# Altium schematic sheet DB10012_ControlPower.SchDoc: Power supply
size A4; SheetNumber: 2; SheetTotal: 6
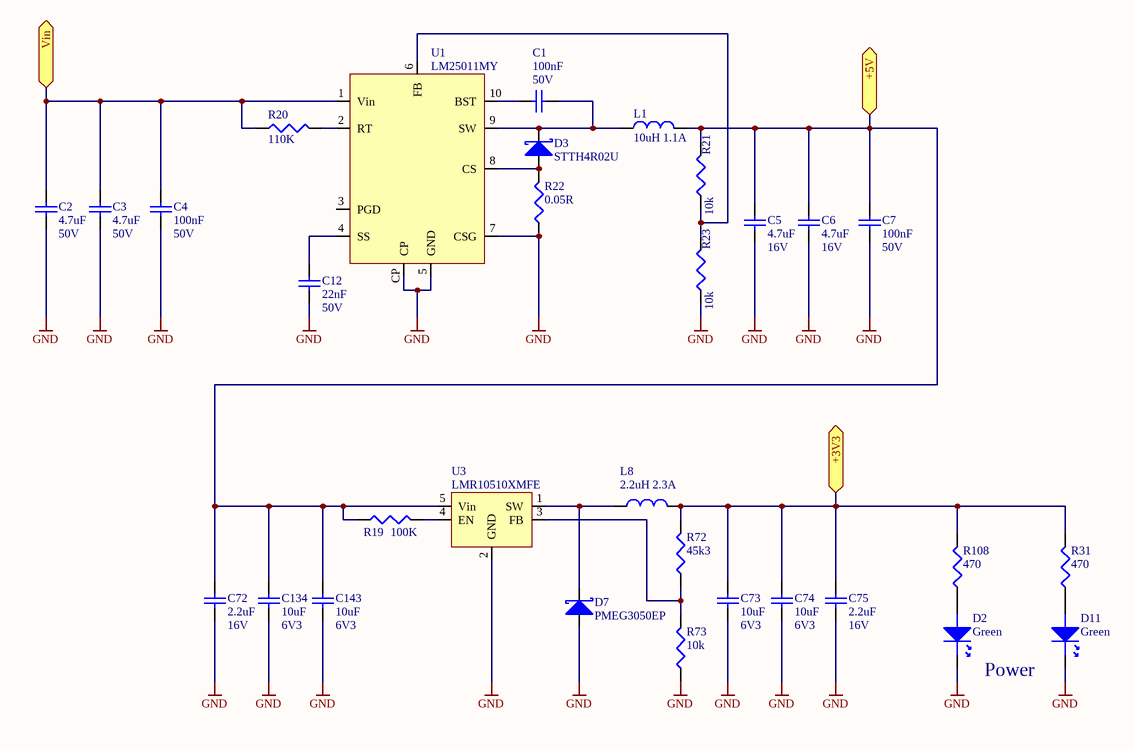
[diagram p0: DB10012_ControlPower.SchDoc]

## Parts
C1  100nF  Voltage Rating: 50V  [C-0805]
C2  4.7uF  Voltage Rating: 50V  [C-1206]
C3  4.7uF  Voltage Rating: 50V  [C-1206]
C4  100nF  Voltage Rating: 50V  [C-0805]
C5  4.7uF  Voltage Rating: 16V  [C-0805]
C6  4.7uF  Voltage Rating: 16V  [C-0805]
C7  100nF  Voltage Rating: 50V  [C-0805]
C12  22nF  Voltage Rating: 50V  [C0402]
C72  2.2uF  Voltage Rating: 16V  [C0603]
C73  10uF  Voltage Rating: 6V3  [C0603]
C74  10uF  Voltage Rating: 6V3  [C0603]
C75  2.2uF  Voltage Rating: 16V  [C0603]
C134  10uF  Voltage Rating: 6V3  [C-0805]
C143  10uF  Voltage Rating: 6V3  [C-0805]
D2  Green  [D-0805]
D3  STTH4R02U  [CASE 403A-03]
D7  PMEG3050EP  [SOD128]
D11  Green  [D-0805]
L1  10uH 1.1A  [WE-TPC 5818, L]
L8  2.2uH 2.3A  [SRN2512]
R19  100K  [0402]
R20  110K  [0603]
R21  10k  [0402]
R22  0.05R  [0805]
R23  10k  [0402]
R31  470  [0402]
R72  45k3  [0402]
R73  10k  [0402]
R108  470  [0402]
U1  LM25011MY  [MUC10A]
U3  LMR10510XMFE  [SOT-23-5]

## Ports
+3V3, +5V, Vin

## Nets
GND: C2.1 C3.1 C4.1 C5.1 C6.1 C7.1 C12.1 C72.1 C73.2 C74.2 C75.1 C134.2 C143.2 D2.K D7.1(A) D11.K R22.1 R23.1 R73.1 U1.5(GND) U1.7(CSG) U1.CP U3.2(GND)
+3V3: C73.1 C74.1 C75.2 L8.1 R31.2 R72.2 R108.2 ; port +3V3
+5V: C5.2 C6.2 C7.2 C72.2 C134.1 C143.1 L1.2 R19.1 R21.2 U3.5(Vin) ; port +5V
Vin: C2.2 C3.2 C4.2 R20.1 U1.1(Vin) ; port Vin
NetC1_1: C1.1 U1.10(BST)
NetC1_2: C1.2 D3.2(K) L1.1 U1.9(SW)
NetC12_2: C12.2 U1.4(SS)
NetD2_A: D2.A R108.1
NetD3_1: D3.1(A) R22.2 U1.8(CS)
NetD7_2: D7.2(K) L8.0 U3.1(SW)
NetD11_A: D11.A R31.1
NetR19_2: R19.2 U3.4(EN)
NetR20_2: R20.2 U1.2(RT)
NetR21_1: R21.1 R23.2 U1.6(FB)
NetR72_1: R72.1 R73.2 U3.3(FB)

Not connected (* = marked no-connect by the designer): U1 3(PGD)

## Notes on the sheet
- Power
- Title
- Size:
- Date:
- A4
- Number:
- Time:
- Revision:
- Sheet
- of
- File:

## Library data of the parts
C1 C4 C7 = 100nF/0805/CER/50V: Capacitor, 100nF, 50V,  X7R; Capacitance Tolerance: ± 10%; Capacitor Case Style: 0805; Brand Number: C0805C104K5RACTU; Brand: KEMET; Dielectric Characteristic: X7R; Capacitance: 100nF; Temperature Range: -55°C to +125°C; Price: 0,022; Order Code Supplier: 1414664; Supplier: Farnell
C2 C3 = 4.7uF/1206/CER/50V: Capacitor, 4.7uF, 50V, X7R; Capacitance Tolerance: ± 10%; Capacitor Case Style: 1206; Brand Number: 12065D475KAT2A; Brand: AVX; Dielectric Characteristic: X7R; Capacitance: 4.7uF; Temperature Range: -55°C to +125°C; Price: 0.371; Order Code Supplier: 2332884; Supplier: Farnell
C5 C6 = 4.7uF/0805/CER/16V: Capacitor, 4.7uF, 16V, X7R; Capacitance Tolerance: ± 10%; Capacitor Case Style: 0805; Brand Number: GRM21BR71C475KA73L; Brand: MURATA; Dielectric Characteristic: X7R; Capacitance: 4.7uF; Temperature Range: -55°C to +125°C; Price: 0,26; Order Code Supplier: 1797015; Supplier: Farnell
C12 = 22nF/0402/CER/50V: Capacitor, 22nF, 50V, X7R; Capacitance Tolerance: ± 5%; Capacitor Case Style: 0402; Brand Number: GRM155R71H223KA12D; Brand: Murata; Dielectric Characteristic: X7R; Capacitance: 22nF; Temperature Range: -55°C to 125°C; Price: 0,0133; Order Code Supplier: 1828888; Supplier: Farnell
C72 C75 = 2.2uF/0603/CER/16V: Capacitor, 2.2uF, 16V, X5R; Capacitance Tolerance: +/- 10%; Capacitor Case Style: 0603; Brand Number: GRM188R61C225KE15D; Brand: MURATA; Dielectric Characteristic: X5R; Capacitance: 2.2uF; Temperature Range: -55°C to 85°C; Price: 0,077; Order Code Supplier: 1735526; Supplier: Farnell
C73 C74 = 10uF/0603/CER/6V3/X5R: Capacitor, 10uF, 6.3V, X5R; Capacitance Tolerance: ± 20%; Brand Number: GRM188R60J106ME47D; Brand: MURATA; Capacitance: 10uF; Dielectric Characteristic: X5R; Capacitor Case Style: C0603; Temperature Range: -55°C to +85°C; Price: 0,117; Order Code Supplier: 1735528; Supplier: Farnell
C134 C143 = 10uF/0805/CER/6V3: Capacitor, 10uF, 6.3V, X7R; Capacitance Tolerance: ± 10%; Capacitor Case Style: 0805; Brand Number: GRM21BR70J106KE76L; Brand: MURATA; Dielectric Characteristic: X7R; Capacitance: 10uF; Temperature Range: -55°C to +125°C; Price: 0,22; Order Code Supplier: 1845768; Supplier: Farnell
D2 D11 = KP-2012SGC: Led, Green, Li:12mcd, Vf:2.2V, If:0.02A; Brand: KingBright; Case Style: 0805; Forward Current: 0.02A; Forward Voltage: 2.2V; Luminous Intensity: 12mcd; Brand Number: KP-2012SGC; Order Code Supplier: 1318243; Price: 0,06; Supplier: Farnell; Temperature Range: -30°C to +85°C
D3 = STTH4R02U: Diode Schottky, Vrrm: 200V, If: 4A, Vf: 1,05V; Brand: STMICROELECTRONICS; Case Style: SMB; Forward Current: 3A; Forward Voltage: 1,05V; Brand Number: STTH4R02U; Order Code Supplier: 1295277; Price: 1,09; Supplier: Farnell; Temperature Range: -65°C to +150°C; Vrrm: 200V
D7 = PMEG3050EP: Diode Schottky, Vrrm: 30V, If: 3A, Vf: 0.36V; Brand: NXP; Case Style: SOD-128; Forward Current: 5A; Brand Number: PMEG3050EP; Forward Voltage: 0.36V; Order Code Supplier: 1829197; Price: 0,25; Supplier: Farnell; Temperature Range: -55°C to +150°C; Vrrm: 30V
L1 = 744052100: 10UH, 30%, 1.1A; Brand: Wurth; Case Style: WE-PD 5818; DC Resistance: 0.13ohm; Brand Number: 744052100; DC Current: 1.1A; Inductance: 10uH; Order Code Supplier: 1635854; Price: 1,36; Q Factor: *; Supplier: Farnell; Temperature Range: -40°C to +125°C
L8 = SRN2512-2R2M: 2.2UH, 20%, 2.3A; Brand: BOURNS; DC Resistance: 0.1ohm; Inductance: 2.2 uH; Brand Number: SRN2512-2R2M; Case Style: SRN2512; DC Current: 2.3A; Order Code Supplier: 2428203; Price: 0,354; Q Factor: *; Supplier: Farnell; Temperature Range: -40°C to +125°C
R19 = 100k/0402/0063W/50V: Resistor, 100k, 0.1%, 0.0625W, 50V, 100PPM, 0402; Brand: VISHAY DRALORIC; Brand Number: CRCW0402100KFKED; Power Rating: 0.063W; Case Style: 0402; Order Code Supplier: 2121857; Price: 0,0004; Resistance: 100K; Supplier: Farnell; Temperature Coefficient: ± 100PPM; Temperature Range: -55°C to +125°C; Voltage Rating: 50V
R20 = 110K/0603/0100W/75V: Resistor, 110K, 0.1%, 0.1W, 75V, 25PPM, 0603; Brand: VISHAY DRALORIC; Brand Number: CRCW0603110KFKEA; Case Style: 0603; Order Code Supplier: 2122623; Power Rating: 0.1W; Price: 0,51; Resistance: 110K; Supplier: Farnell; Temperature Coefficient: ± 25PPM; Temperature Range: -55°C to +155°C; Voltage Rating: 75V
R21 R23 R73 = 10k/0402/0063W/50V: Resistor, 10k, 0.1%, 0.0625W, 50V, 100PPM, 0402; Brand: VISHAY DRALORIC; Brand Number: CRCW040210K0FKED; Power Rating: 0.063W; Case Style: 0402; Order Code Supplier: 2121730; Price: 0,0005; Resistance: 10k; Supplier: Farnell; Temperature Coefficient: ± 100PPM; Temperature Range: -55°C to +125°C; Voltage Rating: 50V
R22 = 0.05/0805/0125W/150V: Resistor, 0.05R, 1%, 0.125W, 150V, 100PPM, 0805; Brand: PANASONIC; Brand Number: ERJL06KF50MV; Case Style: 0805; Order Code Supplier: 1577552; Power Rating: 0.125W; Price: 0,64; Resistance: 0.05R; Supplier: Farnell; Temperature Coefficient: ± 100PPM; Temperature Range: -55°C to +125°C; Voltage Rating: 150V
R31 R108 = 470/0402/0063W/50V: Resistor, 470, 1%, 0.0625W, 50V, 100PPM, 0402; Brand: VISHAY DRALORIC; Brand Number: CRG0402F470R; Power Rating: 0.063W; Case Style: 0402; Order Code Supplier: 2331533; Price: 0,0099; Resistance: 470; Supplier: Farnell; Temperature Coefficient: ± 100PPM; Temperature Range: -55°C to +125°C; Voltage Rating: 50V
R72 = 45k3/0402/0063W/50V: Resistor, 45K3, 0.1%, 0.0625W, 50V, 100PPM, 0402; Brand: VISHAY DRALORIC; Brand Number: CRCW040245K3FKED; Power Rating: 0.063W; Case Style: 0402; Order Code Supplier: 2121812; Price: 0,0054; Resistance: 45k3; Supplier: Farnell; Temperature Coefficient: ± 100PPM; Temperature Range: -55°C to +125°C; Voltage Rating: 50V
U1 = LM25011MY: STEP-DOWN REGULATOR, MSOP-10; Brand: TEXAS INSTRUMENTS; Brand Number: LM25011MY/NOPB; Case Style: MSOP10; Current: 2A; Vout: Adj; Vin-min: 6V; Vin-max: 42V; Order Code Supplier: 2102674; Price: 2,26; Supplier: Farnell; Temperature Range: -40°C to +85°C
U3 = LMR10510XMFE: DC/DC CONV, BUCK, 1.95MHZ, SOT-23-5; Brand: TEXAS INSTRUMENTS; Brand Number: LMR10510XMFE/NOPB; Current: 0.3A; Vout: Adj; Vin-min: 3V; Vin-max: 5.5V; Case Style: SOT-23-5; Order Code Supplier: 2436300; Price: 0,54; Supplier: Farnell; Temperature Range: -40°C to +85°C